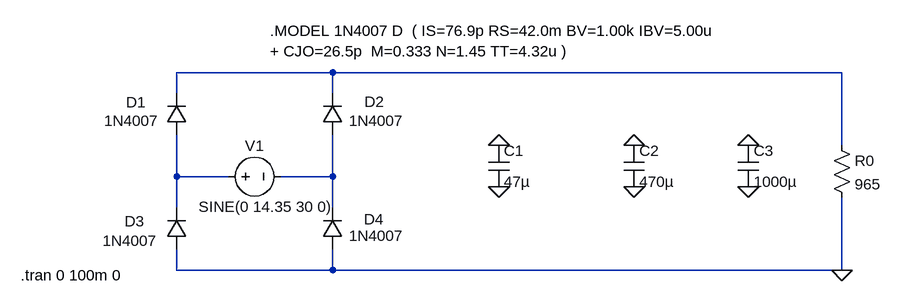
[diagram p0: schematic Retificadores.asc]
Retificadores.asc, the LTspice schematic file:
Version 4
SHEET 1 900 680
WIRE 48 -16 -192 -16
WIRE 832 -16 48 -16
WIRE -192 16 -192 -16
WIRE 48 16 48 -16
WIRE 832 96 832 -16
WIRE 512 112 512 96
WIRE -192 144 -192 80
WIRE -112 144 -192 144
WIRE 48 144 48 80
WIRE 48 144 -32 144
WIRE -192 192 -192 144
WIRE 48 192 48 144
WIRE -192 288 -192 256
WIRE 48 288 48 256
WIRE 48 288 -192 288
WIRE 832 288 832 176
WIRE 832 288 48 288
FLAG 832 288 0
FLAG 512 96 0
FLAG 512 160 0
FLAG 688 96 0
FLAG 688 160 0
FLAG 304 96 0
FLAG 304 160 0
SYMBOL res 816 80 R0
SYMATTR InstName R0
SYMATTR Value 965
SYMBOL diode 64 80 R180
WINDOW 0 -64 51 Left 2
WINDOW 3 -94 22 Left 2
SYMATTR InstName D2
SYMATTR Value 1N4007
SYMBOL diode -176 80 R180
WINDOW 0 63 50 Left 2
WINDOW 3 43 22 Left 2
SYMATTR InstName D1
SYMATTR Value 1N4007
SYMBOL diode -176 256 R180
WINDOW 0 65 43 Left 2
WINDOW 3 45 13 Left 2
SYMATTR InstName D3
SYMATTR Value 1N4007
SYMBOL diode 64 256 R180
WINDOW 0 -63 46 Left 2
WINDOW 3 -94 21 Left 2
SYMATTR InstName D4
SYMATTR Value 1N4007
SYMBOL voltage -128 144 R270
WINDOW 0 32 56 VTop 2
WINDOW 3 -31 73 VBottom 2
WINDOW 123 0 0 Left 0
WINDOW 39 0 0 Left 0
SYMATTR InstName V1
SYMATTR Value SINE(0 14.35 30 0)
SYMBOL cap 288 96 R0
SYMATTR InstName C1
SYMATTR Value 47µ
SYMBOL cap 496 96 R0
SYMATTR InstName C2
SYMATTR Value 470µ
SYMBOL cap 672 96 R0
SYMATTR InstName C3
SYMATTR Value 1000µ
TEXT -48 -80 Left 2 !.MODEL 1N4007 D  ( IS=76.9p RS=42.0m BV=1.00k IBV=5.00u\n+ CJO=26.5p  M=0.333 N=1.45 TT=4.32u )
TEXT -432 296 Left 2 !.tran 0 100m 0

The netlist it stands for:
* Retificadores.asc
R0 N001 0 965
D2 N003 N001 1N4007
D1 N002 N001 1N4007
D3 0 N002 1N4007
D4 0 N003 1N4007
V1 N002 N003 SINE(0 14.35 30 0)
C1 0 0 47µ
C2 0 0 470µ
C3 0 0 1000µ
.model D D
.lib standard.dio
.MODEL 1N4007 D  ( IS=76.9p RS=42.0m BV=1.00k IBV=5.00u
+ CJO=26.5p  M=0.333 N=1.45 TT=4.32u )
.tran 0 100m 0
.backanno
.end